# Altium schematic sheet Balancer.SchDoc
size A4; SheetNumber: 4; SheetTotal: 21
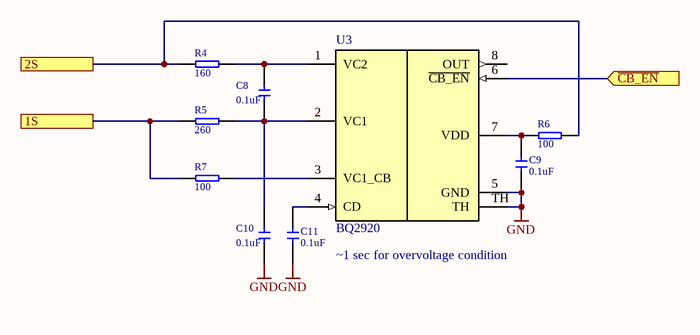
[diagram p0: Balancer.SchDoc]

## Parts
C8  value 0.1uF  [CERCAP 0402]
C9  value 0.1uF  [CERCAP 0402]
C10  value 0.1uF  [CERCAP 0402]
C11  value 0.1uF  [CERCAP 0402]
R4  value 160  [RES 0603]
R5  value 260  [RES 0603]
R6  value 100  [RES 0402]
R7  value 100  [RES 0603]
U3  BQ2920  [VSON-8]

## Ports
1S, 2S, ~{CB_EN} (in)

## Nets
GND: C9.1 C10.1 C11.1 U3.5(GND) U3.TH
1S: R5.1 R7.1 ; port 1S
2S: R4.1 R6.2 ; port 2S
~{CB_EN}: U3.6(~{CB_EN}) ; port ~{CB_EN}
NetC8_1: C8.1 C10.2 R5.2 U3.2(VC1)
NetC8_2: C8.2 R4.2 U3.1(VC2)
NetC9_2: C9.2 R6.1 U3.7(VDD)
NetC11_2: C11.2 U3.4(CD)
NetR7_2: R7.2 U3.3(VC1_CB)

Not connected (* = marked no-connect by the designer): U3 8(OUT)

## Notes on the sheet
- ~1 sec for overvoltage condition

## Library data of the parts
C8-C11 = !Capacitor: Capacitor; IsSMT: NoSMT; Voltage: 50V; Diel: X7R
R4-R7 = !Resistor: Resistor; IsSMT: NoSMT
U3 = BQ2920: 2S li-ion balancer